# Altium schematic sheet ideas.SchDoc
size A1; SheetNumber: 2; SheetTotal: 2
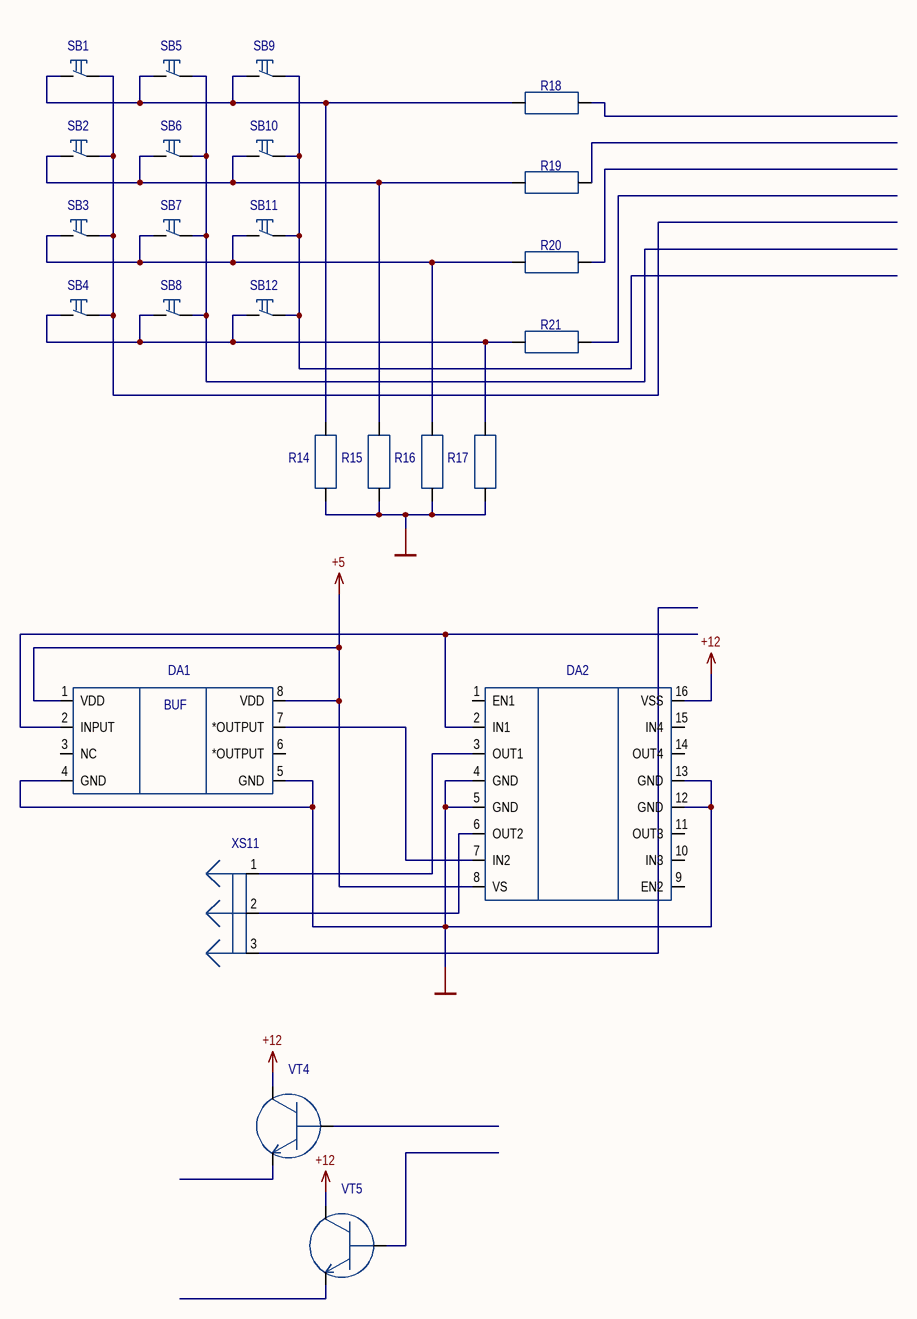
[diagram p0: ideas.SchDoc]

## Parts
DA1  TC4421  (value not drawn)
DA2  L293D  (value not drawn)
R14  res_100K  (value not drawn)
R15  res_100K  (value not drawn)
R16  res_100K  (value not drawn)
R17  res_100K  (value not drawn)
R18  res_1K  (value not drawn)
R19  res_1K  (value not drawn)
R20  res_1K  (value not drawn)
R21  res_1K  (value not drawn)
SB1  keypad_button  (value not drawn)
SB2  keypad_button  (value not drawn)
SB3  keypad_button  (value not drawn)
SB4  keypad_button  (value not drawn)
SB5  keypad_button  (value not drawn)
SB6  keypad_button  (value not drawn)
SB7  keypad_button  (value not drawn)
SB8  keypad_button  (value not drawn)
SB9  keypad_button  (value not drawn)
SB10  keypad_button  (value not drawn)
SB11  keypad_button  (value not drawn)
SB12  keypad_button  (value not drawn)
VT4  2N2926  (value not drawn)
VT5  2N2926  (value not drawn)
XS11  PWM_servo_connector  (value not drawn)

## Nets
+5: DA1.1(VDD) DA1.8(VDD) DA2.8(VS)
+12: DA2.16(VSS) VT4.3(C) VT5.3(C)
GND: DA1.4(GND) DA1.5(GND) DA2.4(GND) DA2.5(GND) DA2.12(GND) DA2.13(GND) R14.1 R15.1 R16.1 R17.1
NetDA1_2: DA1.2(INPUT) DA2.2(IN1)
NetDA1_7: DA1.7(*OUTPUT) DA2.7(IN2)
NetDA2_3: DA2.3(OUT1) XS11.1
NetDA2_6: DA2.6(OUT2) XS11.2
NetR14_2: R14.2 R18.2 SB1.2 SB5.2 SB9.2
NetR15_2: R15.2 R19.2 SB2.2 SB6.2 SB10.2
NetR16_2: R16.2 R20.2 SB3.2 SB7.2 SB11.2
NetR17_2: R17.2 R21.2 SB4.2 SB8.2 SB12.2
NetSB1_1: SB1.1 SB2.1 SB3.1 SB4.1
NetSB5_1: SB5.1 SB6.1 SB7.1 SB8.1
NetSB9_1: SB9.1 SB10.1 SB11.1 SB12.1

Not connected (* = marked no-connect by the designer): DA1 3(NC) 6(*OUTPUT); DA2 1(EN1) 9(EN2) 10(IN3) 11(OUT3) 14(OUT4) 15(IN4); R18 1; R19 1; R20 1; R21 1; VT4 1(E) 2(B); VT5 1(E) 2(B); XS11 3

## Notes on the sheet
- (in symbol TC4421) BUF